# Altium schematic sheet 智能实验室传感器底板.SchDoc
size A4
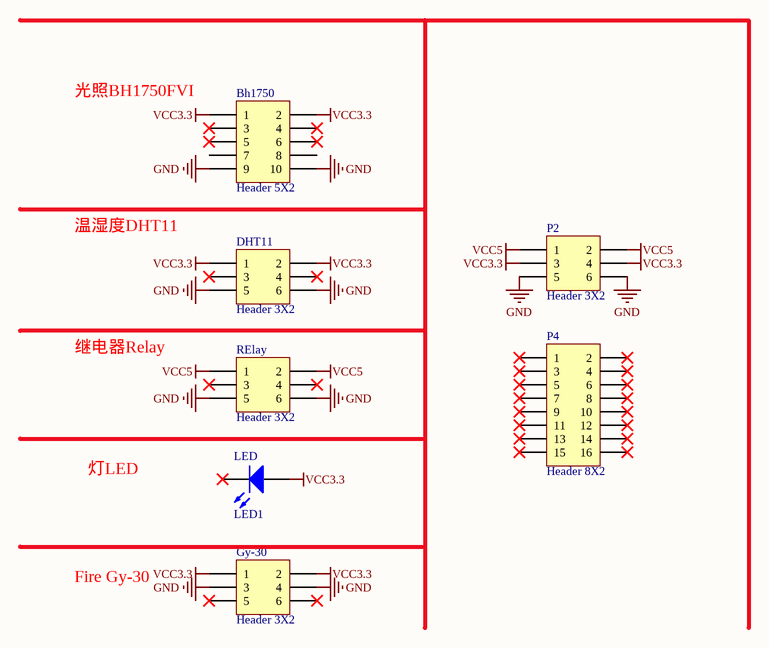
[diagram p0: 智能实验室传感器底板.SchDoc]

## Parts
Bh1750  Header 5X2  [HDR2X5]
DHT11  Header 3X2  [HDR2X3]
Gy-30  Header 3X2  [HDR2X3]
LED  LED1  [LED-1]
P2  Header 3X2  [HDR2X3]
P4  Header 8X2  [HDR2X8]
RElay  Header 3X2  [HDR2X3]

## Nets
GND: Bh1750.9 Bh1750.10 DHT11.5 DHT11.6 Gy-30.3 Gy-30.4 P2.5 P2.6 RElay.5 RElay.6
VCC3.3: Bh1750.1 Bh1750.2 DHT11.1 DHT11.2 Gy-30.1 Gy-30.2 LED.1(A) P2.3 P2.4
VCC5: P2.1 P2.2 RElay.1 RElay.2

Not connected (* = marked no-connect by the designer): Bh1750 3* 4* 5* 6* 7 8; DHT11 3* 4*; Gy-30 5* 6*; LED 2(K)*; P4 1* 2* 3* 4* 5* 6* 7* 8* 9* 10* 11* 12* 13* 14* 15* 16*; RElay 3* 4*

## Notes on the sheet
- 光照BH1750FVI
- 温湿度DHT11
- 继电器Relay
- 灯LED
- Fire Gy-30
- Title
- Size:
- Date:
- A4
- Number:
- Time:
- Revision:
- Sheet
- of
- File:

## Library data of the parts
Bh1750 = Header 5X2: Header, 5-Pin, Dual row; LatestRevisionDate: 17-Jul-2002; LatestRevisionNote: Re-released for DXP Platform.; Publisher: Altium Limited
DHT11 Gy-30 P2 RElay = Header 3X2: Header, 3-Pin, Dual row; LatestRevisionDate: 17-Jul-2002; LatestRevisionNote: Re-released for DXP Platform.; Publisher: Altium Limited
LED = LED1: Typical RED GaAs LED; Published: 8-Jun-2000; LatestRevisionDate: 08-Jul-2005; LatestRevisionNote: Mech Layer 1 removed.; PackageReference: LED-1; Publisher: Altium Limited; PackageDescription: LED; 2 Leads
P4 = Header 8X2: Header, 8-Pin, Dual row; LatestRevisionDate: 17-Jul-2002; LatestRevisionNote: Re-released for DXP Platform.; Publisher: Altium Limited